# Altium project AQCA-Light-Control-A0.PrjPcb
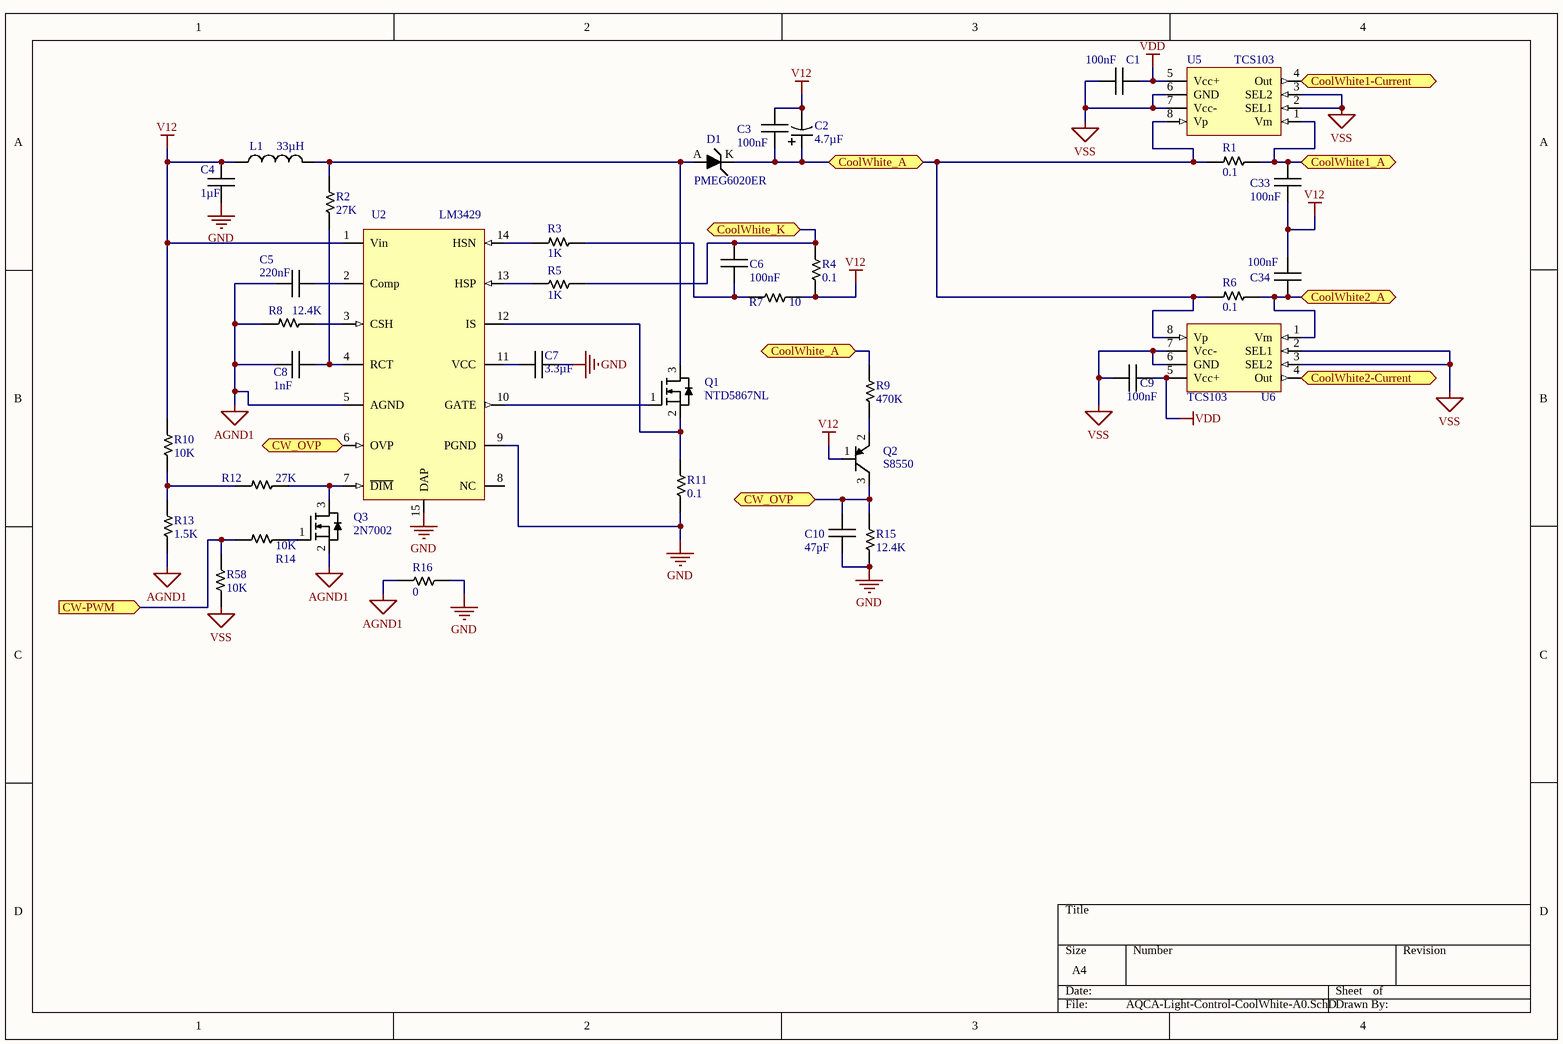
[diagram p0: AQCA-Light-Control-CoolWhite-A0.SchDoc]
4 sheets, 151 parts. Net scope: flat (ports and power ports of the same name join across sheets).
Board file: AQCA-Light-Control-A0.PcbDoc
Sheets:
  AQCA-Light-Control-CoolWhite-A0.SchDoc
  AQCA-Light-Control-Blue-A0.SchDoc
  AQCA-Light-Control-WarmWhite-A0.SchDoc
  AQCA-Light-Control-uC-A0.SchDoc

## Sheet AQCA-Light-Control-CoolWhite-A0.SchDoc
size A4

### Parts
C1  100nF  [CAPC1608N]
C2  4.7µF  [CAPPR2-5x11]
C3  100nF  [CAPC2012N]
C4  1µF  [CAPC1608N]
C5  220nF  [CAPC1608N]
C6  100nF  [CAPC1608N]
C7  3.3µF  [CAPC1608N]
C8  1nF  [CAPC1608N]
C9  100nF  [CAPC1608N]
C10  47pF  [CAPC1608N]
C33  100nF  [CAPC2012N]
C34  100nF  [CAPC2012N]
D1  PMEG6020ER  [SOD123]
L1  33µH  [Inductor AIUR5-6]
Q1  NTD5867NL  [DPAK 369AA]
Q2  S8550  [SOT23_N]
Q3  2N7002  [SOT23-3N]
R1  0.1  [RESC2012N]
R2  27K  [RESC1608N]
R3  1K  [RESC1608N]
R4  0.1  [RESC2012N]
R5  1K  [RESC1608N]
R6  0.1  [RESC2012N]
R7  10  [RESC1608N]
R8  12.4K  [RESC1608N]
R9  470K  [RESC1608N]
R10  10K  [RESC1608N]
R11  0.1  [RESC6332N]
R12  27K  [RESC1608N]
R13  1.5K  [RESC1608N]
R14  10K  [RESC1608N]
R15  12.4K  [RESC1608N]
R16  0  [RESC1608N]
R58  10K  [RESC1608N]
U2  LM3429  [TSOP65P640_HS-14N]
U5  TCS103  [TSSOP8N_N]
U6  TCS103  [TSSOP8N_N]

### Ports
CoolWhite1-Current, CoolWhite1_A, CoolWhite2-Current, CoolWhite2_A, CoolWhite_A, CoolWhite_K, CW-PWM (in), CW_OVP

### Nets
AGND1: C5.1 C8.1 Q3.2(S) R8.2 R13.1 R16.1 U2.5(AGND)
GND: C4.1 C7.1 C10.1 R11.1 R15.1 R16.2 U2.9(PGND) U2.15(DAP)
V12: C2.2 C3.2 C4.2 C33.1 C34.2 L1.1 Q2.1(B) R4.1 R7.2 R10.2 U2.1(Vin)
VDD: C1.1 C9.1 U5.5(Vcc+) U6.5(Vcc+)
VSS: C1.2 C9.2 R58.2 U5.2(SEL1) U5.3(SEL2) U5.6(GND) U5.7(Vcc-) U6.2(SEL1) U6.3(SEL2) U6.6(GND) U6.7(Vcc-)
NetC2_1: C2.1 C3.1 D1.K(Kathode) R1.2 R6.2 R9.2 U5.8(Vp) U6.8(Vp) ; port CoolWhite_A
NetC5_2: C5.2 U2.2(Comp)
NetC6_1: C6.1 R3.1 R7.1
NetC6_2: C6.2 R4.2 R5.2 ; port CoolWhite_K
NetC7_2: C7.2 U2.11(VCC)
NetC8_2: C8.2 R2.1 U2.4(RCT)
NetC10_2: C10.2 Q2.3(C) R15.2 U2.6(OVP) ; port CW_OVP
NetC33_2: C33.2 R1.1 U5.1(Vm) ; port CoolWhite1_A
NetC34_1: C34.1 R6.1 U6.1(Vm) ; port CoolWhite2_A
NetD1_A: D1.A(Anode) L1.2 Q1.3(D) R2.2
NetQ1_1: Q1.1(G) U2.10(GATE)
NetQ1_2: Q1.2(S) R11.2 U2.12(IS)
NetQ2_2: Q2.2(E) R9.1
NetQ3_1: Q3.1(G) R14.1
NetQ3_3: Q3.3(D) R12.1 U2.7(~{DIM})
NetR3_2: R3.2 U2.14(HSN)
NetR5_1: R5.1 U2.13(HSP)
NetR8_1: R8.1 U2.3(CSH)
NetR10_1: R10.1 R12.2 R13.2
NetR14_2: R14.2 R58.1 ; port CW-PWM
NetU1_2: U5.4(Out) ; port CoolWhite1-Current
NetU1_3: U6.4(Out) ; port CoolWhite2-Current

Not connected (* = marked no-connect by the designer): U2 8(NC)

### Library data of the parts
C1 C6 C7 C9 = Capacitor: Voltage: 16V
  C1 C6 C9: Value: 100nF
  C7: Value: 3.3µF
C2 = Capacitor Polarised: Voltage: 100V; Value: 4.7µF
C3 C10 C33 C34 = Capacitor: Voltage: 100V
  C3 C33 C34: Value: 100nF
  C10: Value: 47pF
C4 C5 = Capacitor: Voltage: 25V
  C4: Value: 1µF
  C5: Value: 220nF
C8 = Capacitor: Voltage: 50V; Value: 1nF
D1 = Schottky Diode: pin to pad: A>1 K>2; Vf: 0.46V; Vr: 60V; If: 2A; Model: PMEG6020ER
L1 = Inductor: DC Current: 5.2A; Value: 33µH
Q1 = MOSFET N-Ch: pin to pad: 2>3 3>4; Vdss: 60V; Id: 20A; RdsON: 0.05; Model: NTD5867NL
Q2 = PNP: pin to pad: 1>3 3>1; Model: S8550
Q3 = MOSFET N-Ch: Vdss: 60V; Id: 115mA; RdsON: 7.5; Model: 2N7002
R1-R16 R58 = Resistor
  R1 R4 R6 R11: Value: 0.1
  R2 R12: Value: 27K
  R3 R5: Value: 1K
  R7: Value: 10
  R8 R15: Value: 12.4K
  R9: Value: 470K
  R10 R14 R58: Value: 10K
  R13: Value: 1.5K
  R16: Value: 0

## Sheet AQCA-Light-Control-Blue-A0.SchDoc
size A4
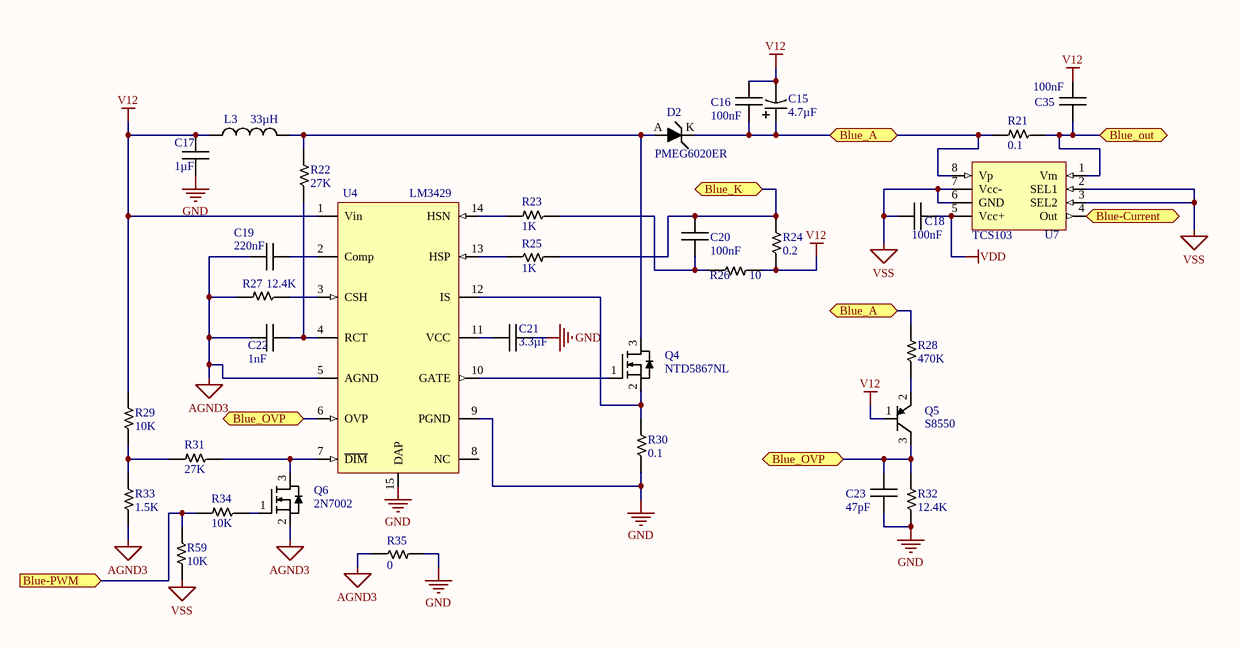
[diagram p1: AQCA-Light-Control-Blue-A0.SchDoc]

### Parts
C15  4.7µF  [CAPPR2-5x11]
C16  100nF  [CAPC2012N]
C17  1µF  [CAPC1608N]
C18  100nF  [CAPC1608N]
C19  220nF  [CAPC1608N]
C20  100nF  [CAPC1608N]
C21  3.3µF  [CAPC1608N]
C22  1nF  [CAPC1608N]
C23  47pF  [CAPC1608N]
C35  100nF  [CAPC2012N]
D2  PMEG6020ER  [SOD123]
L3  33µH  [Inductor AIUR5-6]
Q4  NTD5867NL  [DPAK 369AA]
Q5  S8550  [SOT23_N]
Q6  2N7002  [SOT23-3N]
R21  0.1  [RESC2012N]
R22  27K  [RESC1608N]
R23  1K  [RESC1608N]
R24  0.2  [RESC6332N]
R25  1K  [RESC1608N]
R26  10  [RESC1608N]
R27  12.4K  [RESC1608N]
R28  470K  [RESC1608N]
R29  10K  [RESC1608N]
R30  0.1  [RESC6332N]
R31  27K  [RESC1608N]
R32  12.4K  [RESC1608N]
R33  1.5K  [RESC1608N]
R34  10K  [RESC1608N]
R35  0  [RESC1608N]
R59  10K  [RESC1608N]
U4  LM3429  [TSOP65P640_HS-14N]
U7  TCS103  [TSSOP8N_N]

### Ports
Blue-Current, Blue-PWM (in), Blue_A, Blue_K, Blue_out, Blue_OVP

### Nets
AGND3: C19.1 C22.1 Q6.2(S) R27.2 R33.1 R35.1 U4.5(AGND)
GND: C17.1 C21.1 C23.1 R30.1 R32.1 R35.2 U4.9(PGND) U4.15(DAP)
V12: C15.2 C16.2 C17.2 C35.2 L3.1 Q5.1(B) R24.1 R26.2 R29.2 U4.1(Vin)
VDD: C18.1 U7.5(Vcc+)
VSS: C18.2 R59.2 U7.2(SEL1) U7.3(SEL2) U7.6(GND) U7.7(Vcc-)
NetC15_1: C15.1 C16.1 D2.K(Kathode) R21.2 R28.2 U7.8(Vp) ; port Blue_A
NetC19_2: C19.2 U4.2(Comp)
NetC20_1: C20.1 R23.1 R26.1
NetC20_2: C20.2 R24.2 R25.2 ; port Blue_K
NetC21_2: C21.2 U4.11(VCC)
NetC22_2: C22.2 R22.1 U4.4(RCT)
NetC23_2: C23.2 Q5.3(C) R32.2 U4.6(OVP) ; port Blue_OVP
NetC35_1: C35.1 R21.1 U7.1(Vm) ; port Blue_out
NetD2_A: D2.A(Anode) L3.2 Q4.3(D) R22.2
NetQ4_1: Q4.1(G) U4.10(GATE)
NetQ4_2: Q4.2(S) R30.2 U4.12(IS)
NetQ5_2: Q5.2(E) R28.1
NetQ6_1: Q6.1(G) R34.1
NetQ6_3: Q6.3(D) R31.1 U4.7(~{DIM})
NetR23_2: R23.2 U4.14(HSN)
NetR25_1: R25.1 U4.13(HSP)
NetR27_1: R27.1 U4.3(CSH)
NetR29_1: R29.1 R31.2 R33.2
NetR34_2: R34.2 R59.1 ; port Blue-PWM
NetU1_5: U7.4(Out) ; port Blue-Current

Not connected (* = marked no-connect by the designer): U4 8(NC)

### Library data of the parts
C15 = Capacitor Polarised: Voltage: 100V; Value: 4.7µF
C16 C23 C35 = Capacitor: Voltage: 100V
  C16 C35: Value: 100nF
  C23: Value: 47pF
C17 C19 = Capacitor: Voltage: 25V
  C17: Value: 1µF
  C19: Value: 220nF
C18 C21 = Capacitor: Voltage: 16V
  C18: Value: 100nF
  C21: Value: 3.3µF
C20 C22 = Capacitor: Voltage: 50V
  C20: Value: 100nF
  C22: Value: 1nF
D2 = Schottky Diode: pin to pad: A>1 K>2; Vf: 0.46V; Vr: 60V; If: 2A; Model: PMEG6020ER
L3 = Inductor: DC Current: 5.2A; Value: 33µH
Q4 = MOSFET N-Ch: pin to pad: 2>3 3>4; Vdss: 60V; Id: 20A; RdsON: 0.05; Model: NTD5867NL
Q5 = PNP: pin to pad: 1>3 3>1; Model: S8550
Q6 = MOSFET N-Ch: Vdss: 60V; Id: 115mA; RdsON: 7.5; Model: 2N7002
R21-R35 R59 = Resistor
  R21 R30: Value: 0.1
  R22 R31: Value: 27K
  R23 R25: Value: 1K
  R24: Value: 0.2
  R26: Value: 10
  R27 R32: Value: 12.4K
  R28: Value: 470K
  R29 R34 R59: Value: 10K
  R33: Value: 1.5K
  R35: Value: 0

## Sheet AQCA-Light-Control-WarmWhite-A0.SchDoc
size A4
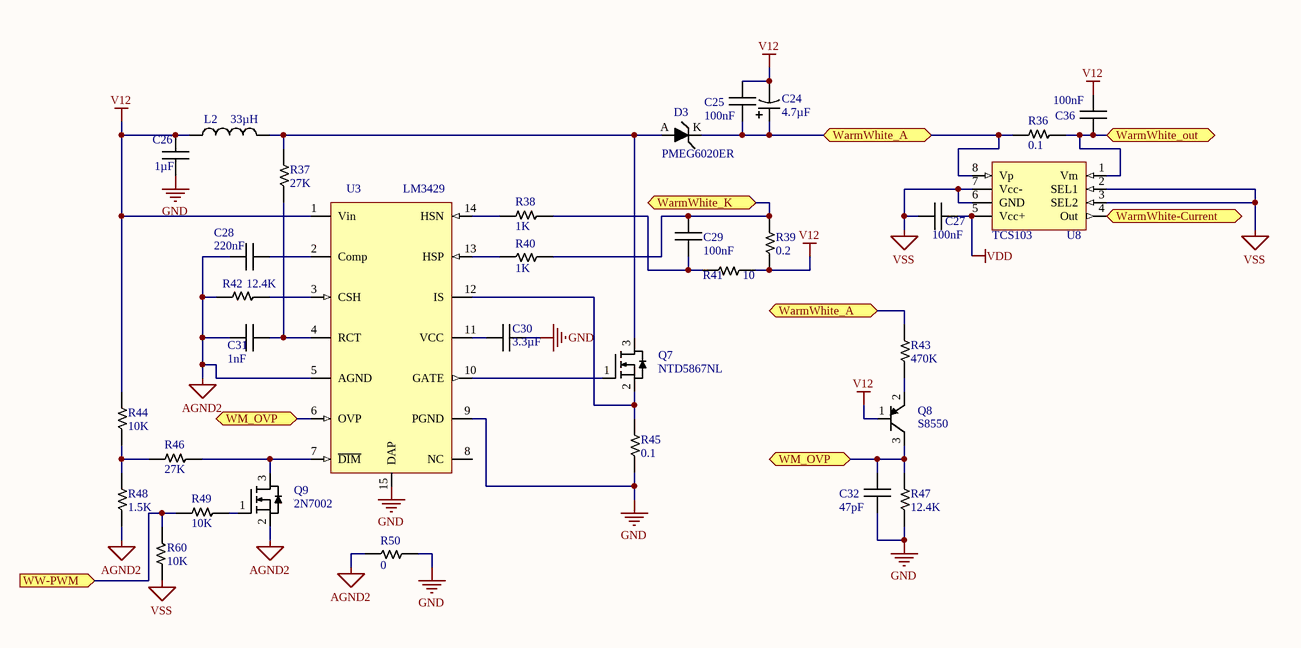
[diagram p2: AQCA-Light-Control-WarmWhite-A0.SchDoc]

### Parts
C24  4.7µF  [CAPPR2-5x11]
C25  100nF  [CAPC2012N]
C26  1µF  [CAPC1608N]
C27  100nF  [CAPC1608N]
C28  220nF  [CAPC1608N]
C29  100nF  [CAPC1608N]
C30  3.3µF  [CAPC1608N]
C31  1nF  [CAPC1608N]
C32  47pF  [CAPC1608N]
C36  100nF  [CAPC2012N]
D3  PMEG6020ER  [SOD123]
L2  33µH  [Inductor AIUR5-6]
Q7  NTD5867NL  [DPAK 369AA]
Q8  S8550  [SOT23_N]
Q9  2N7002  [SOT23-3N]
R36  0.1  [RESC2012N]
R37  27K  [RESC1608N]
R38  1K  [RESC1608N]
R39  0.2  [RESC6332N]
R40  1K  [RESC1608N]
R41  10  [RESC1608N]
R42  12.4K  [RESC1608N]
R43  470K  [RESC1608N]
R44  10K  [RESC1608N]
R45  0.1  [RESC6332N]
R46  27K  [RESC1608N]
R47  12.4K  [RESC1608N]
R48  1.5K  [RESC1608N]
R49  10K  [RESC1608N]
R50  0  [RESC1608N]
R60  10K  [RESC1608N]
U3  LM3429  [TSOP65P640_HS-14N]
U8  TCS103  [TSSOP8N_N]

### Ports
WarmWhite-Current, WarmWhite_A, WarmWhite_K, WarmWhite_out, WM_OVP, WW-PWM (in)

### Nets
AGND2: C28.1 C31.1 Q9.2(S) R42.2 R48.1 R50.1 U3.5(AGND)
GND: C26.1 C30.1 C32.1 R45.1 R47.1 R50.2 U3.9(PGND) U3.15(DAP)
V12: C24.2 C25.2 C26.2 C36.2 L2.1 Q8.1(B) R39.1 R41.2 R44.2 U3.1(Vin)
VDD: C27.1 U8.5(Vcc+)
VSS: C27.2 R60.2 U8.2(SEL1) U8.3(SEL2) U8.6(GND) U8.7(Vcc-)
NetC24_1: C24.1 C25.1 D3.K(Kathode) R36.2 R43.2 U8.8(Vp) ; port WarmWhite_A
NetC28_2: C28.2 U3.2(Comp)
NetC29_1: C29.1 R38.1 R41.1
NetC29_2: C29.2 R39.2 R40.2 ; port WarmWhite_K
NetC30_2: C30.2 U3.11(VCC)
NetC31_2: C31.2 R37.1 U3.4(RCT)
NetC32_2: C32.2 Q8.3(C) R47.2 U3.6(OVP) ; port WM_OVP
NetC36_1: C36.1 R36.1 U8.1(Vm) ; port WarmWhite_out
NetD3_A: D3.A(Anode) L2.2 Q7.3(D) R37.2
NetQ7_1: Q7.1(G) U3.10(GATE)
NetQ7_2: Q7.2(S) R45.2 U3.12(IS)
NetQ8_2: Q8.2(E) R43.1
NetQ9_1: Q9.1(G) R49.1
NetQ9_3: Q9.3(D) R46.1 U3.7(~{DIM})
NetR38_2: R38.2 U3.14(HSN)
NetR40_1: R40.1 U3.13(HSP)
NetR42_1: R42.1 U3.3(CSH)
NetR44_1: R44.1 R46.2 R48.2
NetR49_2: R49.2 R60.1 ; port WW-PWM
NetU1_4: U8.4(Out) ; port WarmWhite-Current

Not connected (* = marked no-connect by the designer): U3 8(NC)

### Library data of the parts
C24 = Capacitor Polarised: Voltage: 100V; Value: 4.7µF
C25 C32 C36 = Capacitor: Voltage: 100V
  C25 C36: Value: 100nF
  C32: Value: 47pF
C26 C28 = Capacitor: Voltage: 25V
  C26: Value: 1µF
  C28: Value: 220nF
C27 C30 = Capacitor: Voltage: 16V
  C27: Value: 100nF
  C30: Value: 3.3µF
C29 C31 = Capacitor: Voltage: 50V
  C29: Value: 100nF
  C31: Value: 1nF
D3 = Schottky Diode: pin to pad: A>1 K>2; Vf: 0.46V; Vr: 60V; If: 2A; Model: PMEG6020ER
L2 = Inductor: DC Current: 5.2A; Value: 33µH
Q7 = MOSFET N-Ch: pin to pad: 2>3 3>4; Vdss: 60V; Id: 20A; RdsON: 0.05; Model: NTD5867NL
Q8 = PNP: pin to pad: 1>3 3>1; Model: S8550
Q9 = MOSFET N-Ch: Vdss: 60V; Id: 115mA; RdsON: 7.5; Model: 2N7002
R36-R50 R60 = Resistor
  R36 R45: Value: 0.1
  R37 R46: Value: 27K
  R38 R40: Value: 1K
  R39: Value: 0.2
  R41: Value: 10
  R42 R47: Value: 12.4K
  R43: Value: 470K
  R44 R49 R60: Value: 10K
  R48: Value: 1.5K
  R50: Value: 0

## Sheet AQCA-Light-Control-uC-A0.SchDoc
size A4
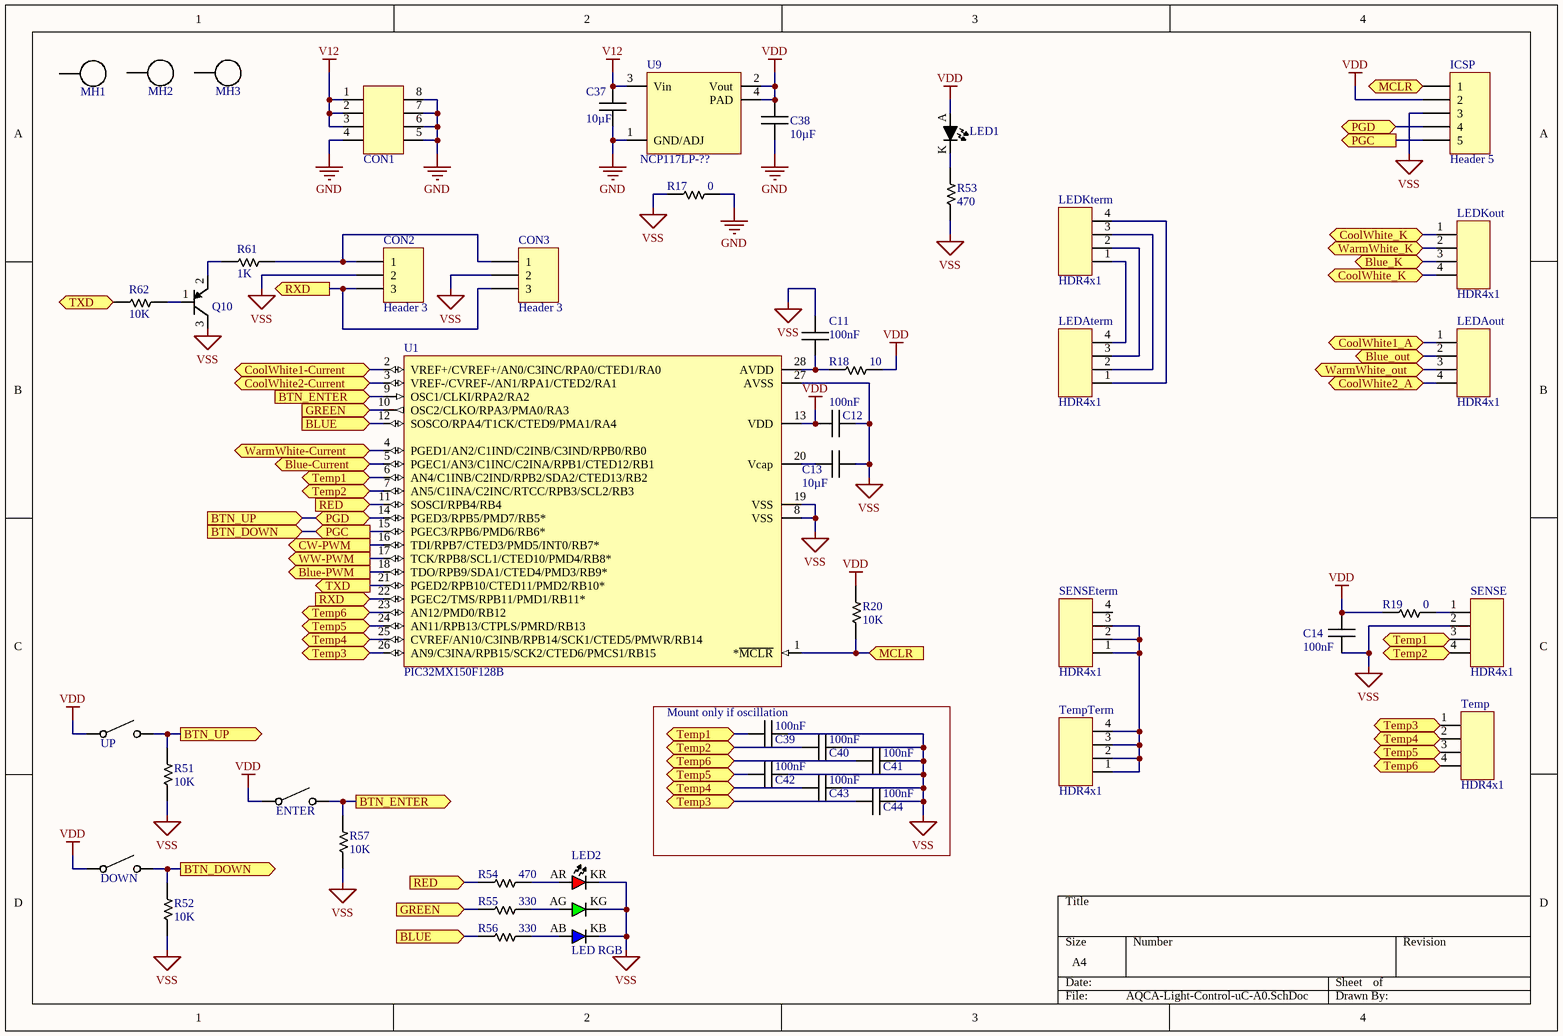
[diagram p3: AQCA-Light-Control-uC-A0.SchDoc]

### Parts
C11  100nF  [CAPC1608N]
C12  100nF  [CAPC1608N]
C13  10µF  [CAPC2012N]
C14  100nF  [CAPC1608N]
C37  10µF  [CAPC3225N]
C38  10µF  [CAPC3225N]
C39  100nF  [CAPC1608N]
C40  100nF  [CAPC1608N]
C41  100nF  [CAPC1608N]
C42  100nF  [CAPC1608N]
C43  100nF  [CAPC1608N]
C44  100nF  [CAPC1608N]
CON1  Molex Mini-Fit 8pin  [Molex Mini-Fit 8pin]  (value not drawn)
CON2  Header 3  [HDR1X3]
CON3  Header 3  [HDR1X3]
DOWN  Tact Button NO  [TACT SMD 4.5×4.5mm]  (value not drawn)
ENTER  Tact Button NO  [TACT SMD 4.5×4.5mm]  (value not drawn)
ICSP  Header 5  [HDR1X5]
LED1  (no value)  [LED 3216m]
LED2  LED RGB  [LED PLCC-6]
LEDAout  HDR4x1  [HDR4x1 EDGE female]
LEDAterm  HDR4x1  [HDR4x1 EDGE male]
LEDKout  HDR4x1  [HDR4x1 EDGE female]
LEDKterm  HDR4x1  [HDR4x1 EDGE male]
MH1  Mounting Hole  [Mount Hole 4-6.5]  (value not drawn)
MH2  Mounting Hole  [Mount Hole 4-6.5]  (value not drawn)
MH3  Mounting Hole  [Mount Hole 4-6.5]  (value not drawn)
Q10  *  [SOT23_N]  (value not drawn)
R17  0  [RESC1608N]
R18  10  [RESC1608N]
R19  0  [RESC1608N]
R20  10K  [RESC1608N]
R51  10K  [RESC1608N]
R52  10K  [RESC1608N]
R53  470  [RESC1608N]
R54  470  [RESC1608N]
R55  330  [RESC1608N]
R56  330  [RESC1608N]
R57  10K  [RESC1608N]
R61  1K  [RESC1608N]
R62  10K  [RESC1608N]
SENSE  HDR4x1  [HDR4x1 EDGE female]
SENSEterm  HDR4x1  [HDR4x1 EDGE male]
Temp  HDR4x1  [HDR4x1 EDGE female]
TempTerm  HDR4x1  [HDR4x1 EDGE male]
U1  PIC32MX150F128B  [SSOP28_N]
U9  NCP117LP-??  [SOT223-4N]
UP  Tact Button NO  [TACT SMD 4.5×4.5mm]  (value not drawn)

### Blocks framed on the sheet
Mount only if oscillation: C39-C44

### Ports
BLUE (in), Blue-Current, Blue-PWM (out), Blue_K, Blue_out, BTN_DOWN (in), BTN_DOWN (out), BTN_ENTER (in), BTN_ENTER (out), BTN_UP (in), BTN_UP (out), CoolWhite1-Current, CoolWhite1_A, CoolWhite2-Current, CoolWhite2_A, CoolWhite_K, CW-PWM (out), GREEN (in), MCLR (in), MCLR (out), PGC (in), PGC (out), PGD (bidir), RED (in), RXD (in), RXD (out), Temp1, Temp2, Temp3, Temp4, Temp5, Temp6, TXD (in), TXD (out), WarmWhite-Current, WarmWhite_K, WarmWhite_out, WW-PWM (out)

### Nets
GND: C37.1 C38.1 CON1.4 CON1.5 CON1.6 CON1.7 CON1.8 R17.2 U9.1(GND/ADJ)
V12: C37.2 CON1.1 CON1.2 CON1.3 U9.3(Vin)
VDD: C12.1 C14.2 C38.2 DOWN.1 ENTER.1 ICSP.2 LED1.A R18.2 R19.1 R20.2 U1.13(VDD) U9.2(Vout) U9.4(PAD) UP.1
VSS: C11.2 C12.2 C13.2 C14.1 C39.2 C40.2 C41.2 C42.2 C43.2 C44.2 CON2.2 CON3.2 ICSP.3 LED2.KB LED2.KG LED2.KR Q10.3(C) R17.1 R51.1 R52.1 R53.1 R57.1 SENSE.2 U1.8(VSS) U1.19(VSS) U1.27(AVSS)
NetC6_2: LEDKout.1 LEDKout.4 ; port CoolWhite_K
NetC11_1: C11.1 R18.1 U1.28(AVDD)
NetC13_1: C13.1 U1.20(Vcap)
NetC20_2: LEDKout.3 ; port Blue_K
NetC29_2: LEDKout.2 ; port WarmWhite_K
NetC33_2: LEDAout.1 ; port CoolWhite1_A
NetC34_1: LEDAout.4 ; port CoolWhite2_A
NetC35_1: LEDAout.2 ; port Blue_out
NetC36_1: LEDAout.3 ; port WarmWhite_out
NetC39_1: C39.1 SENSE.3 U1.6(AN4/C1INB/C2IND/RPB2/SDA2/CTED13/RB2) ; port Temp1
NetC40_1: C40.1 SENSE.4 U1.7(AN5/C1INA/C2INC/RTCC/RPB3/SCL2/RB3) ; port Temp2
NetC41_1: C41.1 Temp.4 U1.23(AN12/PMD0/RB12) ; port Temp6
NetC42_1: C42.1 Temp.3 U1.24(AN11/RPB13/CTPLS/PMRD/RB13) ; port Temp5
NetC43_1: C43.1 Temp.2 U1.25(CVREF/AN10/C3INB/RPB14/SCK1/CTED5/PMWR/RB14) ; port Temp4
NetC44_1: C44.1 Temp.1 U1.26(AN9/C3INA/RPB15/SCK2/CTED6/PMCS1/RB15) ; port Temp3
NetCON2_1: CON2.1 CON3.1 R61.2
NetCON2_3: CON2.3 CON3.3 U1.22(PGEC2/TMS/RPB11/PMD1/RB11*) ; port RXD
NetDOWN_2: DOWN.2 ICSP.5 R52.2 U1.15(PGEC3/RPB6/PMD6/RB6*) ; port PGC, port BTN_DOWN
NetENTER_2: ENTER.2 R57.2 U1.9(OSC1/CLKI/RPA2/RA2) ; port BTN_ENTER
NetICSP_1: ICSP.1 R20.1 U1.1(*~{MCLR}) ; port MCLR
NetICSP_4: ICSP.4 R51.2 U1.14(PGED3/RPB5/PMD7/RB5*) UP.2 ; port PGD, port BTN_UP
NetLED1_K: LED1.K R53.2
NetLED2_AB: LED2.AB R56.2
NetLED2_AG: LED2.AG R55.2
NetLED2_AR: LED2.AR R54.2
NetLEDAterm_1: LEDAterm.1 LEDKterm.4
NetLEDAterm_2: LEDAterm.2 LEDKterm.3
NetLEDAterm_3: LEDAterm.3 LEDKterm.2
NetLEDAterm_4: LEDAterm.4 LEDKterm.1
NetQ10_1: Q10.1(B) R62.2
NetQ10_2: Q10.2(E) R61.1
NetR14_2: U1.16(TDI/RPB7/CTED3/PMD5/INT0/RB7*) ; port CW-PWM
NetR19_2: R19.2 SENSE.1
NetR34_2: U1.18(TDO/RPB9/SDA1/CTED4/PMD3/RB9*) ; port Blue-PWM
NetR49_2: U1.17(TCK/RPB8/SCL1/CTED10/PMD4/RB8*) ; port WW-PWM
NetR54_1: R54.1 U1.11(SOSCI/RPB4/RB4) ; port RED
NetR55_1: R55.1 U1.10(OSC2/CLKO/RPA3/PMA0/RA3) ; port GREEN
NetR56_1: R56.1 U1.12(SOSCO/RPA4/T1CK/CTED9/PMA1/RA4) ; port BLUE
NetR62_1: R62.1 U1.21(PGED2/RPB10/CTED11/PMD2/RB10*) ; port TXD
NetSENSEterm_1: SENSEterm.1 SENSEterm.2 SENSEterm.3 TempTerm.1 TempTerm.2 TempTerm.3 TempTerm.4
NetU1_2: U1.2(VREF+/CVREF+/AN0/C3INC/RPA0/CTED1/RA0) ; port CoolWhite1-Current
NetU1_3: U1.3(VREF-/CVREF-/AN1/RPA1/CTED2/RA1) ; port CoolWhite2-Current
NetU1_4: U1.4(PGED1/AN2/C1IND/C2INB/C3IND/RPB0/RB0) ; port WarmWhite-Current
NetU1_5: U1.5(PGEC1/AN3/C1INC/C2INA/RPB1/CTED12/RB1) ; port Blue-Current

Not connected (* = marked no-connect by the designer): MH1 1; MH2 1; MH3 1; SENSEterm 4

### Library data of the parts
C11-C14 C39-C44 = Capacitor: Voltage: 16V
  C11 C12 C14 C39-C44: Value: 100nF
  C13: Value: 10µF
C37 C38 = Capacitor: Voltage: 25V; Value: 10µF
CON2 CON3 = Header 3: Header, 3-Pin; LatestRevisionDate: 17-Jul-2002; LatestRevisionNote: Re-released for DXP Platform.; Publisher: Altium Limited
DOWN ENTER UP = Tact Button NO: pin to pad: 2>4
ICSP = Header 5: Header, 5-Pin; LatestRevisionDate: 17-Jul-2002; LatestRevisionNote: Re-released for DXP Platform.; Publisher: Altium Limited
LED1 = LED
LED2 = LED RGB: pin to pad: AB>6 AG>2 AR>4 KB>5 KG>1 KR>3
Q10 = PNP: pin to pad: 1>3 3>1; Model: *
R17-R20 R51-R57 R61 R62 = Resistor
  R17 R19: Value: 0
  R18: Value: 10
  R20 R51 R52 R57 R62: Value: 10K
  R53 R54: Value: 470
  R55 R56: Value: 330
  R61: Value: 1K
U1 = PIC32MX120FxxxB
U9 = NCP1117LP: Vin: 3.3V; Vout: 18V; Iout: 1A

## Nets that join several sheets
GND: AQCA-Light-Control-CoolWhite-A0 (8 pins), AQCA-Light-Control-Blue-A0 (8 pins), AQCA-Light-Control-WarmWhite-A0 (8 pins), AQCA-Light-Control-uC-A0 (9 pins)
V12: AQCA-Light-Control-CoolWhite-A0 (11 pins), AQCA-Light-Control-Blue-A0 (10 pins), AQCA-Light-Control-WarmWhite-A0 (10 pins), AQCA-Light-Control-uC-A0 (5 pins)
VDD: AQCA-Light-Control-CoolWhite-A0 (C1.1 C9.1 U5.5 U6.5), AQCA-Light-Control-Blue-A0 (C18.1 U7.5), AQCA-Light-Control-WarmWhite-A0 (C27.1 U8.5), AQCA-Light-Control-uC-A0 (14 pins)
VSS: AQCA-Light-Control-CoolWhite-A0 (11 pins), AQCA-Light-Control-Blue-A0 (6 pins), AQCA-Light-Control-WarmWhite-A0 (6 pins), AQCA-Light-Control-uC-A0 (26 pins)
NetC6_2: AQCA-Light-Control-CoolWhite-A0 (C6.2 R4.2 R5.2), AQCA-Light-Control-uC-A0 (LEDKout.1 LEDKout.4)
NetC20_2: AQCA-Light-Control-Blue-A0 (C20.2 R24.2 R25.2), AQCA-Light-Control-uC-A0 (LEDKout.3)
NetC29_2: AQCA-Light-Control-WarmWhite-A0 (C29.2 R39.2 R40.2), AQCA-Light-Control-uC-A0 (LEDKout.2)
NetC33_2: AQCA-Light-Control-CoolWhite-A0 (C33.2 R1.1 U5.1), AQCA-Light-Control-uC-A0 (LEDAout.1)
NetC34_1: AQCA-Light-Control-CoolWhite-A0 (C34.1 R6.1 U6.1), AQCA-Light-Control-uC-A0 (LEDAout.4)
NetC35_1: AQCA-Light-Control-Blue-A0 (C35.1 R21.1 U7.1), AQCA-Light-Control-uC-A0 (LEDAout.2)
NetC36_1: AQCA-Light-Control-WarmWhite-A0 (C36.1 R36.1 U8.1), AQCA-Light-Control-uC-A0 (LEDAout.3)
NetR14_2: AQCA-Light-Control-CoolWhite-A0 (R14.2 R58.1), AQCA-Light-Control-uC-A0 (U1.16)
NetR34_2: AQCA-Light-Control-Blue-A0 (R34.2 R59.1), AQCA-Light-Control-uC-A0 (U1.18)
NetR49_2: AQCA-Light-Control-WarmWhite-A0 (R49.2 R60.1), AQCA-Light-Control-uC-A0 (U1.17)
NetU1_2: AQCA-Light-Control-CoolWhite-A0 (U5.4), AQCA-Light-Control-uC-A0 (U1.2)
NetU1_3: AQCA-Light-Control-CoolWhite-A0 (U6.4), AQCA-Light-Control-uC-A0 (U1.3)
NetU1_4: AQCA-Light-Control-WarmWhite-A0 (U8.4), AQCA-Light-Control-uC-A0 (U1.4)
NetU1_5: AQCA-Light-Control-Blue-A0 (U7.4), AQCA-Light-Control-uC-A0 (U1.5)